# EAGLE design BNO055_SCH (EAGLE 9.6.2)
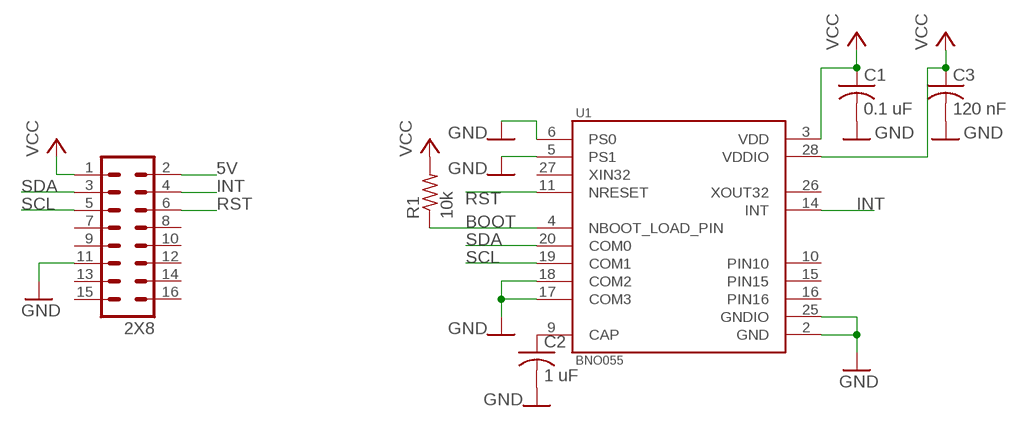
[diagram p0: schematic, sheet 1]

## Parts
2X8  MA08-2  [MA08-2]
C1  0.1 uF  C-USC1206  [C1206]
C2  1 uF  C-USC1206  [C1206]
C3  120 nF  C-USC1206  [C1206]
R1  10k  R-US_R1206  [R1206]
U1  BNO055  [LGA28R50P4X10_380X520X100]

## Nets
5V: 2X8.2
BOOT: R1.1 U1.4(NBOOT_LOAD_PIN)
GND: 2X8.11 C1.2 C2.2 C3.2 U1.2(GND) U1.5(PS1) U1.6(PS0) U1.17(COM3) U1.18(COM2) U1.25(GNDIO)
INT: 2X8.4 U1.14(INT)
N$3: C2.1 U1.9(CAP)
RST: 2X8.6 U1.11(NRESET)
SCL: 2X8.5 U1.19(COM1)
SDA: 2X8.3 U1.20(COM0)
VCC: 2X8.1 C1.1 C3.1 R1.2 U1.3(VDD) U1.28(VDDIO)
Unconnected: 2X8.7 2X8.8 2X8.9 2X8.10 2X8.12 2X8.13 2X8.14 2X8.15 2X8.16 U1.26(XOUT32) U1.27(XIN32)

## Power pins joined to a net without a drawn wire
PIN10: U1.10(PIN10)
PIN15: U1.15(PIN15)
PIN16: U1.16(PIN16)

## Library data of the parts
2X8 = con-lstb:MA08-2: PIN HEADER; OC_FARNELL: unknown; OC_NEWARK: unknown
C1-C3 = rcl:C-US: CAPACITOR, American symbol; SPICEPREFIX: C
R1 = rcl:R-US_: RESISTOR, American symbol; SPICEPREFIX: R
U1 = BNO055:BNO055: BNO055 9-axis Absolute Orientation Sensor ( SiP ) w/Sensors and Sensor Fusion Check prices <https://pricing.snapeda.com/parts/BNO055/Bosch/view-part?ref=eda>; AVAILABILITY: Warning; DESCRIPTION: Accelerometer, Gyroscope, Magnetometer, 9 Axis Sensor I²C, UART Output; MF: Bosch; MP: BNO055; PACKAGE: LGA-28 Bosch; PRICE: None; PURCHASE-URL: https://pricing.snapeda.com/search/part/BNO055/?ref=eda

## Net classes
0 default: width 0.254 mm, drill 0.508 mm, clearance 0.254 mm

## Board
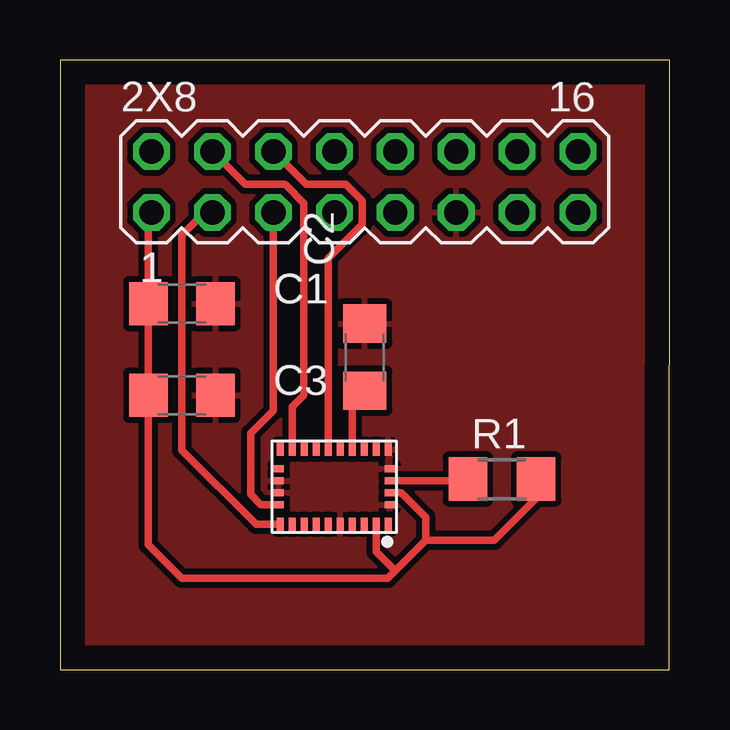
[diagram p1: board, top side]

Size 25.4 x 25.4 mm. Coordinates in mm from the lower left corner, seen from the top.
Outline: 0,0 25.38,0 25.4,25.4 0,25.4 0,0
Copper layers (1*16): Top 0.035mm / dielectric 1.5mm / Bottom 0.035mm
Design rules "default": minimum track width 6mil, minimum drill 0.35mm, track to track 6mil, track to pad 6mil, pad to pad 6mil, via to via 6mil, smd to smd 6mil, copper to edge 40mil, drill to drill 6mil, minimum pad ring 10mil, minimum via ring 8mil, stop-mask expansion 4mil, vias tented up to drill 0mil, thermal gap 10mil

### Footprints (pad centres in the part's own frame; a part is rotated, then mirrored left to right if it is on the bottom)
MA08-2 = drill 1.016 octagon: 1 -8.89,-1.27; 2 -8.89,1.27; 3 -6.35,-1.27; 4 -6.35,1.27; 5 -3.81,-1.27; 6 -3.81,1.27; 7 -1.27,-1.27; 8 -1.27,1.27; 9 1.27,-1.27; 10 1.27,1.27; 11 3.81,-1.27; 12 3.81,1.27; 13 6.35,-1.27; 14 6.35,1.27; 15 8.89,-1.27; 16 8.89,1.27
C1206 = smd 1.6 x 1.8: 1 -1.4,0; 2 1.4,0
R1206 = smd 1.6 x 1.803: 1 -1.422,0; 2 1.422,0
LGA28R50P4X10_380X520X100 = smd 0.3 x 0.525: 1 -2.25,1.562; 6 -2.25,-1.562; 7 -1.75,-1.562; 8 -1.25,-1.562; 9 -0.75,-1.562; 10 -0.25,-1.562; 11 0.25,-1.562; 12 0.75,-1.562; 13 1.25,-1.562; 14 1.75,-1.562; 15 2.25,-1.562; 20 2.25,1.562; 21 1.75,1.562; 22 1.25,1.562; 23 0.75,1.562; 24 0.25,1.562; 25 -0.25,1.562; 26 -0.75,1.562; 27 -1.25,1.562; 28 -1.75,1.562 | smd 0.425 x 0.3: 2 -2.312,0.75; 3 -2.312,0.25; 4 -2.312,-0.25; 5 -2.312,-0.75; 16 2.312,-0.75; 17 2.312,-0.25; 18 2.312,0.25; 19 2.312,0.75

### Placement (x,y rotation side)
2X8  12.7,20.32 0 top
C1  5.08,15.24 0 top
C2  12.7,13.02 90 top
C3  5.08,11.43 0 top
R1  18.41,7.94 0 top
U1  11.43,7.62 180 top

### Tracks (layer width: path | path; a pad name or v marks a point on that pad's centre or on a via)
BOOT
  Top 0.305: R1.1 16.93,7.87 U1.4
GND
  pour Top: -1.27,26.67 -1.27,-1.27 26.67,-1.27 26.67,26.67
INT
  Top 0.305: U1.14 9.68,10.95 10.16,11.43 10.16,19.43 9.4,20.19 9.37,20.22 7.72,20.22 2X8.4
N$3
  Top 0.305: U1.9 12.18,11.1 C2.1
RST
  Top 0.305: 2X8.6 10.26,20.22 11.91,20.22 12.6,19.53 12.6,18.57 11.18,17.15 U1.11
SCL
  Top 0.305: 2X8.5 8.89,10.79 7.94,9.84 7.94,7.3 8.37,6.87 U1.19
SDA
  Top 0.305: 2X8.3 6.03,19.05 5.08,18.1 5.08,9.15 8.17,6.06 U1.20
VCC
  Top 0.305: 2X8.1 3.68,18.92 C1.1 C3.1 3.68,5.21 5.08,3.81 13.65,3.81 13.97,4.13 | U1.3 14.22,7.37 15.24,6.35 15.24,5.4 | 15.24,5.4 18.1,5.4 19.84,7.14 R1.2 | 13.97,4.13 15.24,5.4 | U1.28 13.18,4.92 13.97,4.13